# EAGLE design 6in1 (EAGLE 9.6.2)
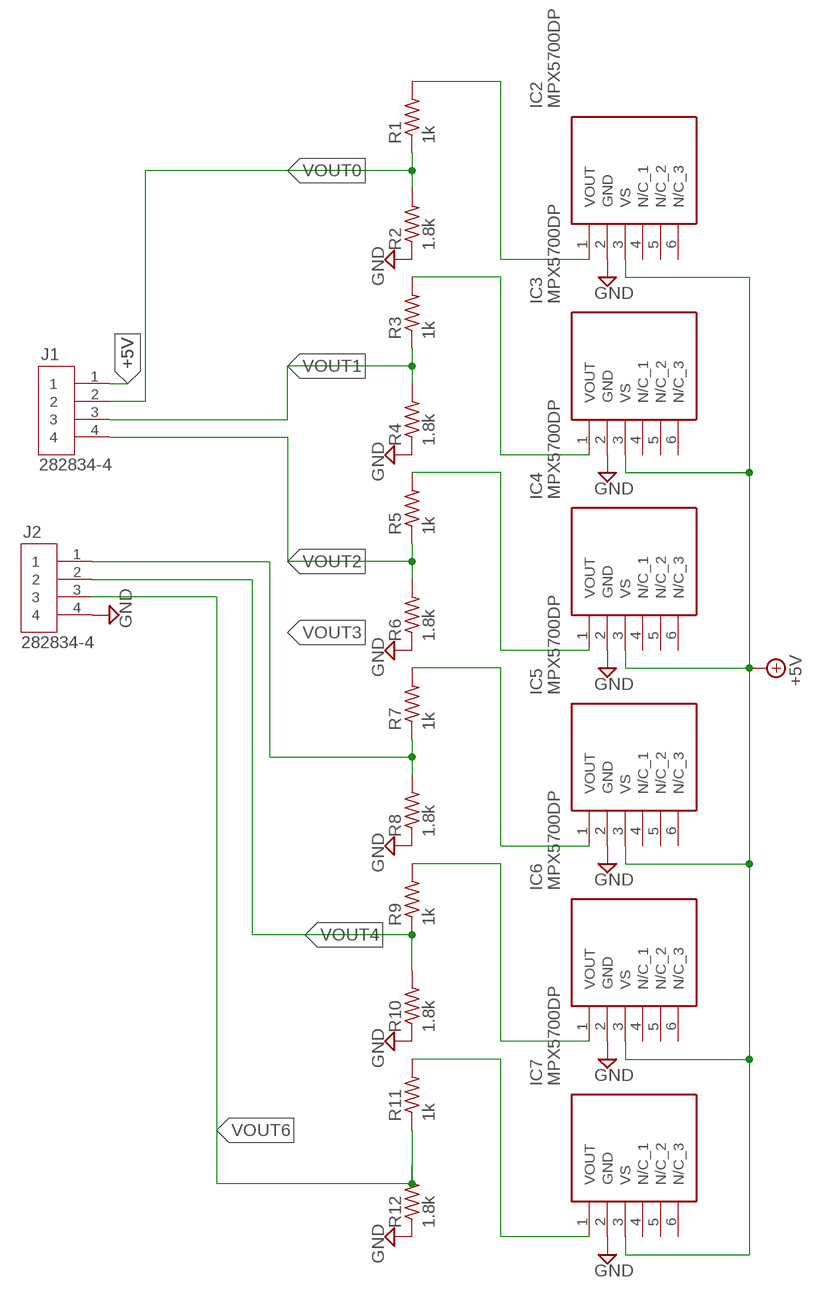
[diagram p0: schematic, sheet 1]

## Parts
IC2  MPX5700DP  [MPX5700DP]
IC3  MPX5700DP  [MPX5700DP]
IC4  MPX5700DP  [MPX5700DP]
IC5  MPX5700DP  [MPX5700DP]
IC6  MPX5700DP  [MPX5700DP]
IC7  MPX5700DP  [MPX5700DP]
J1  282834-4  [HDRV4W85P254_4X1_1062X650X1000]
J2  282834-4  [HDRV4W85P254_4X1_1062X650X1000]
R1  1k  R-US_0204/2V  [0204V]
R2  1.8k  R-US_0204/2V  [0204V]
R3  1k  R-US_0204/2V  [0204V]
R4  1.8k  R-US_0204/2V  [0204V]
R5  1k  R-US_0204/2V  [0204V]
R6  1.8k  R-US_0204/2V  [0204V]
R7  1k  R-US_0204/2V  [0204V]
R8  1.8k  R-US_0204/2V  [0204V]
R9  1k  R-US_0204/2V  [0204V]
R10  1.8k  R-US_0204/2V  [0204V]
R11  1k  R-US_0204/2V  [0204V]
R12  1.8k  R-US_0204/2V  [0204V]

## Nets
+5V: IC2.3(VS) IC3.3(VS) IC4.3(VS) IC5.3(VS) IC6.3(VS) IC7.3(VS) J1.1
GND: IC2.2(GND) IC3.2(GND) IC4.2(GND) IC5.2(GND) IC6.2(GND) IC7.2(GND) J2.4 R2.1 R4.1 R6.1 R8.1 R10.1 R12.1
N$1: IC2.1(VOUT) R1.2
N$3: IC3.1(VOUT) R3.2
N$5: IC4.1(VOUT) R5.2
N$8: IC5.1(VOUT) R7.2
N$9: IC6.1(VOUT) R9.2
N$10: IC7.1(VOUT) R11.2
VOUT0: J1.2 R1.1 R2.2
VOUT1: J1.3 R3.1 R4.2
VOUT2: J1.4 R5.1 R6.2
VOUT3: J2.1 R7.1 R8.2
VOUT4: J2.2 R9.1 R10.2
VOUT6: J2.3 R11.1 R12.2
Unconnected: IC2.4(N/C_1) IC2.5(N/C_2) IC2.6(N/C_3) IC3.4(N/C_1) IC3.5(N/C_2) IC3.6(N/C_3) IC4.4(N/C_1) IC4.5(N/C_2) IC4.6(N/C_3) IC5.4(N/C_1) IC5.5(N/C_2) IC5.6(N/C_3) IC6.4(N/C_1) IC6.5(N/C_2) IC6.6(N/C_3) IC7.4(N/C_1) IC7.5(N/C_2) IC7.6(N/C_3)

## Library data of the parts
IC2-IC7 = MPX5700DP:MPX5700DP: Integrated Silicon Pressure Sensor Source: Datasheet <https://datasheet.datasheetarchive.com/originals/distributors/Datasheets-111/DSAP0037438.pdf>; DESCRIPTION: Integrated Silicon Pressure Sensor; HEIGHT: 29.34mm; MANUFACTURER_NAME: Motorola; MANUFACTURER_PART_NUMBER: MPX5700DP
J1 J2 = terminal:282834-4: Wire to Board 4 Position 2.54 mm Pitch 30-16 AWG Euro Style Terminal Block Check prices <https://pricing.snapeda.com/parts/282834-4/TE%20Connectivity/view-part?ref=eda>; AVAILABILITY: In Stock; CENTERLINE_PITCH: 2.54 mm[.1 in]; COMMENT: 282834-4; DESCRIPTION: 4 Position Wire to Board Terminal Block Horizontal with Board 0.100 (2.54mm) Through Hole; EU_ROHS_COMPLIANCE: Compliant with Exemptions; MF: TE Connectivity; MP: 282834-4; NUMBER_OF_POSITIONS: 4; PACKAGE: None; PRICE: None; PURCHASE-URL: https://pricing.snapeda.com/search/part/282834-4/?ref=eda
R1-R12 = rcl:R-US_: RESISTOR, American symbol

## Board
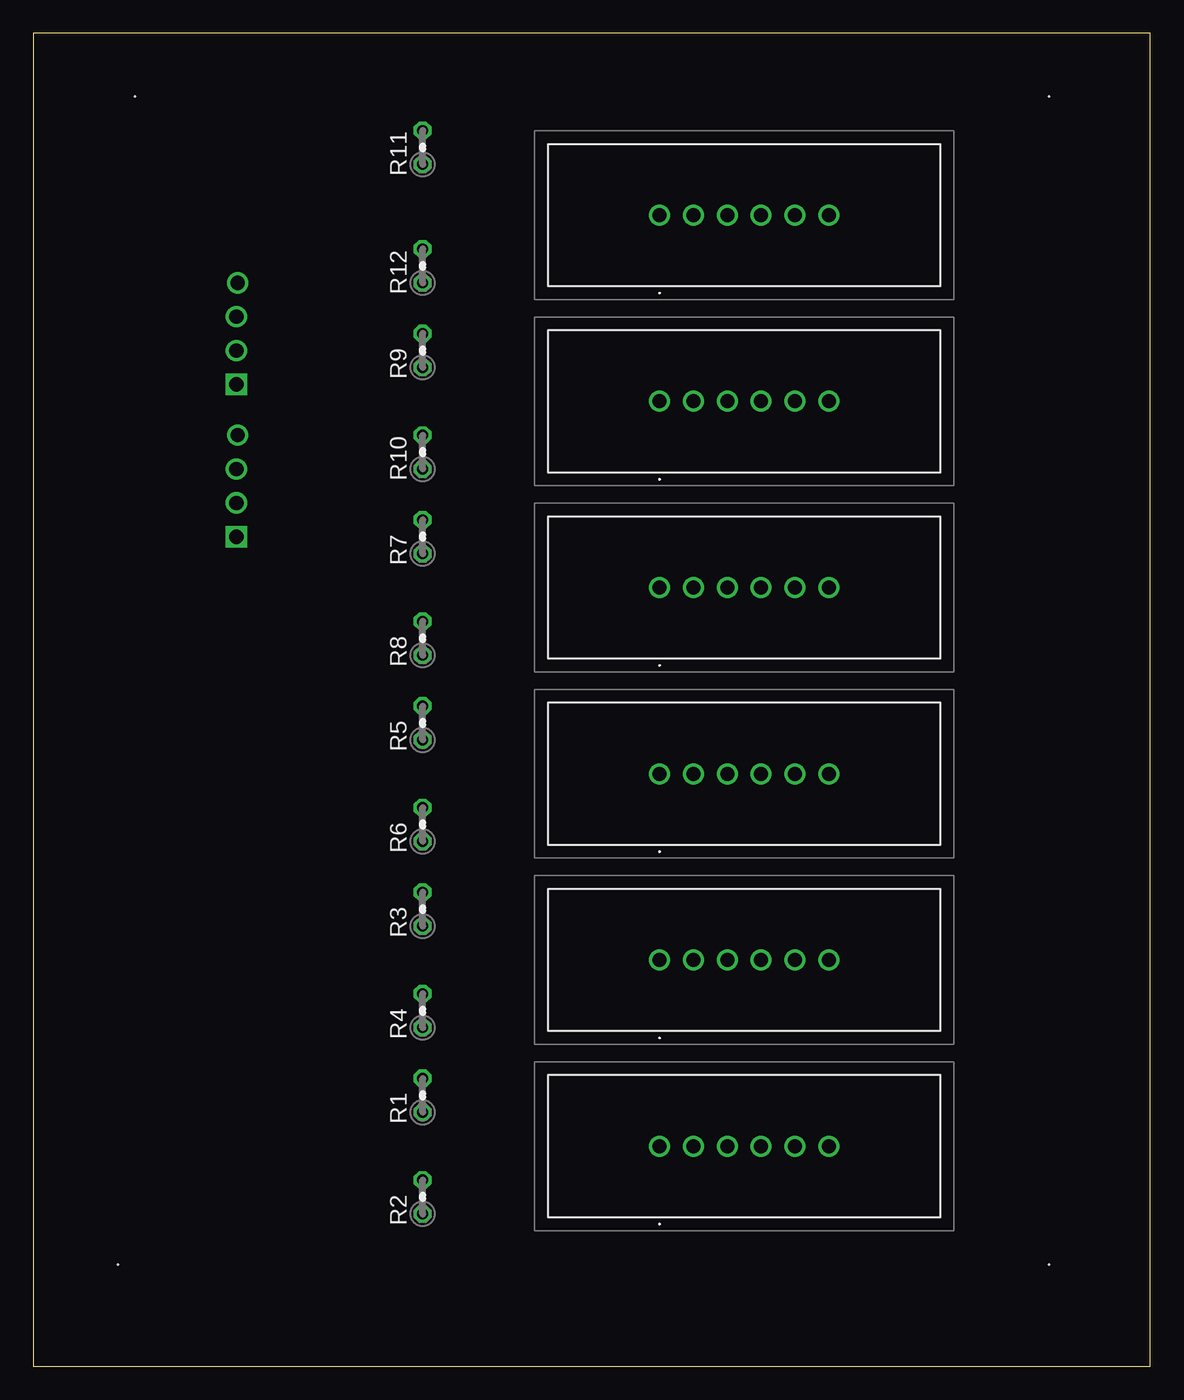
[diagram p1: board, top side]
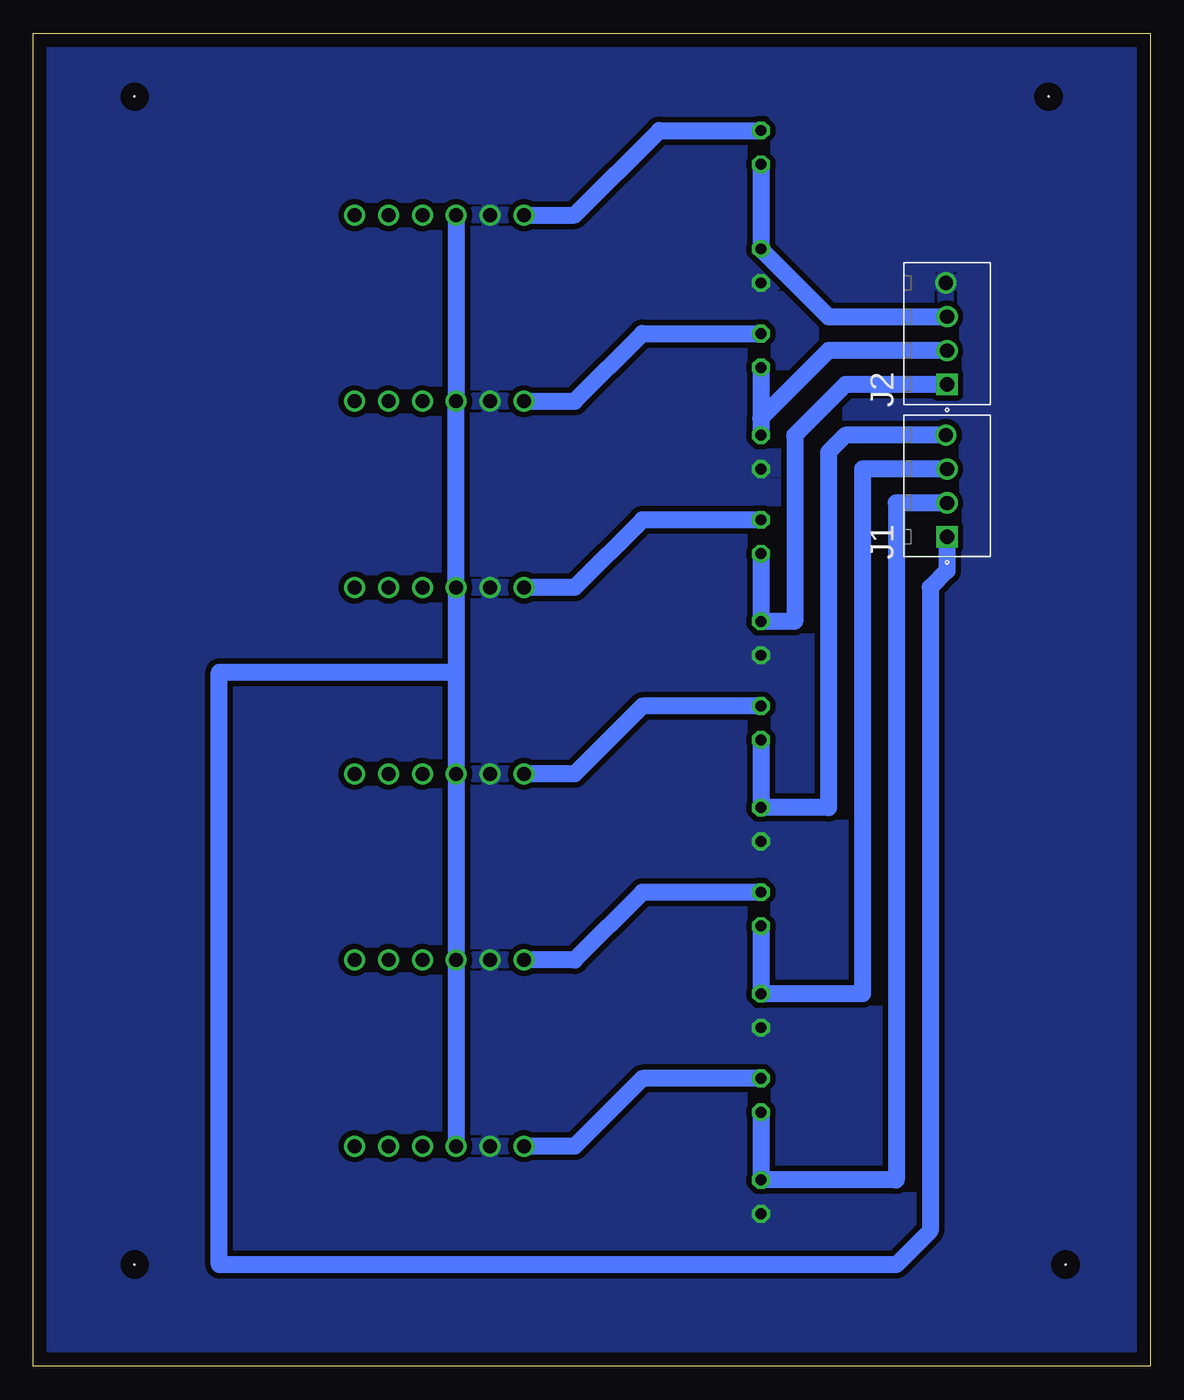
[diagram p2: board, bottom side, seen from below]

Size 83.8 x 100 mm. Coordinates in mm from the lower left corner, seen from the top.
Outline: 0,0 83.8,0 83.8,100 0,100 0,0
Copper layers (1*16): Top 0.035mm / dielectric 1.5mm / Bottom 0.035mm
Design rules "default": minimum track width 6mil, minimum drill 0.35mm, track to track 6mil, track to pad 6mil, pad to pad 6mil, via to via 6mil, smd to smd 6mil, copper to edge 40mil, drill to drill 6mil, minimum pad ring 10mil, minimum via ring 8mil, stop-mask expansion 4mil, vias tented up to drill 0mil, thermal gap 10mil
Holes 0.08 mm at 7.62,95.25 76.2,95.25 6.35,7.62 76.2,7.62 7.62,95.25

### Footprints (pad centres in the part's own frame; a part is rotated, then mirrored left to right if it is on the bottom)
MPX5700DP = drill 1.05 pad 1.575: 1 0,0; 2 2.54,0; 3 5.08,0; 4 7.62,0; 5 10.16,0; 6 12.7,0
HDRV4W85P254_4X1_1062X650X1000 = drill 1.06 square: 1 0,0 | drill 1.06: 2 2.54,0; 3 5.08,0; 4 7.62,0.1
0204V = drill 0.813 octagon: 1 -1.27,0; 2 1.27,0

### Placement (x,y rotation side)
IC2  46.99,16.51 0 top
IC3  46.99,30.48 0 top
IC4  46.99,44.45 0 top
IC5  46.99,58.42 0 top
IC6  46.99,72.39 0 top
IC7  46.99,86.36 0 top
J1  15.24,62.23 90 bottom
J2  15.24,73.66 90 bottom
R1  29.21,20.32 90 top
R2  29.21,12.7 90 top
R3  29.21,34.29 90 top
R4  29.21,26.67 90 top
R5  29.21,48.26 90 top
R6  29.21,40.64 90 top
R7  29.21,62.23 90 top
R8  29.21,54.61 90 top
R9  29.21,76.2 90 top
R10  29.21,68.58 90 top
R11  29.21,91.44 90 top
R12  29.21,82.55 90 top

### Tracks (layer width: path | path; a pad name or v marks a point on that pad's centre or on a via)
+5V
  Bottom 1.27: J1.1 15.24,59.69 16.51,58.42 16.51,10.16 19.05,7.62 69.85,7.62 69.85,52.07 52.07,52.07 | 52.07,52.07 IC4.3 IC3.3 IC2.3 | 52.07,52.07 IC5.3 IC6.3 IC7.3
GND
  pour Bottom (isolate 0.406): 0,100.33 0,0 83.82,0 83.82,100.33
N$1
  Bottom 1.27: R1.2 38.1,21.59 43.18,16.51 IC2.1
N$3
  Bottom 1.27: R3.2 38.1,35.56 43.18,30.48 IC3.1
N$5
  Bottom 1.27: R5.2 38.1,49.53 43.18,44.45 IC4.1
N$8
  Bottom 1.27: R7.2 38.1,63.5 43.18,58.42 IC5.1
N$9
  Bottom 1.27: IC6.1 43.18,72.39 38.1,77.47 R9.2
N$10
  Bottom 1.27: IC7.1 43.18,86.36 36.83,92.71 R11.2
VOUT0
  Bottom 1.27: J1.2 19.05,64.77 19.05,13.97 R2.2 R1.1
VOUT1
  Bottom 1.27: R3.1 R4.2 21.59,27.94 21.59,67.31 J1.3
VOUT2
  Bottom 1.27: R5.1 R6.2 24.13,41.91 24.13,68.58 22.86,69.85 J1.4
VOUT3
  Bottom 1.27: R7.1 R8.2 26.67,55.88 26.67,69.85 22.86,73.66 J2.1
VOUT4
  Bottom 1.27: R9.1 R10.2 29.21,71.12 24.13,76.2 J2.2
VOUT6
  Bottom 1.27: R11.1 R12.2 24.13,78.74 J2.3